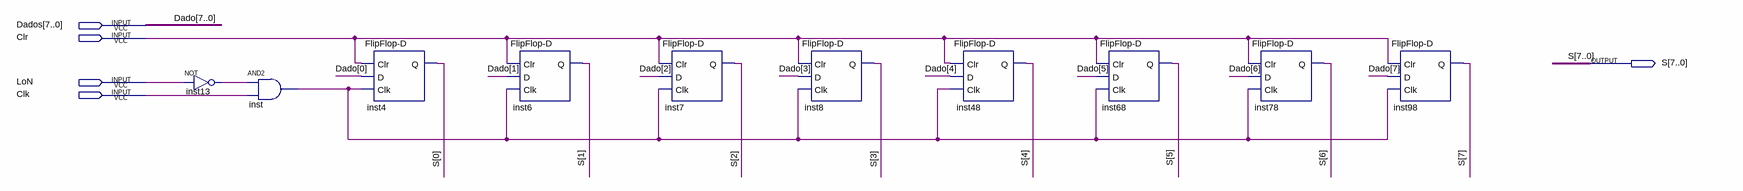
[diagram p0: schematic sheet]
// Quartus schematic Registrador-Saida.bdf as structural Verilog: 10 symbols, 5 pins
module \Registrador-Saida  (
  input  [7:0] Dados,
  input  Clr,
  input  LoN,
  input  Clk,
  output [7:0] S
);

  wire inst13_out, inst_out;

  not inst13 (inst13_out, LoN);
  and inst (inst_out, inst13_out, Clk);
  \FlipFlop-D  inst4 (.Clr(Clr), .D(Dados[0]), .Clk(inst_out), .Q(S[0]));
  \FlipFlop-D  inst6 (.Clr(Clr), .D(Dados[1]), .Clk(inst_out), .Q(S[1]));
  \FlipFlop-D  inst7 (.Clr(Clr), .D(Dados[2]), .Clk(inst_out), .Q(S[2]));
  \FlipFlop-D  inst8 (.Clr(Clr), .D(Dados[3]), .Clk(inst_out), .Q(S[3]));
  \FlipFlop-D  inst48 (.Clr(Clr), .D(Dados[4]), .Clk(inst_out), .Q(S[4]));
  \FlipFlop-D  inst68 (.Clr(Clr), .D(Dados[5]), .Clk(inst_out), .Q(S[5]));
  \FlipFlop-D  inst78 (.Clr(Clr), .D(Dados[6]), .Clk(inst_out), .Q(S[6]));
  \FlipFlop-D  inst98 (.Clr(Clr), .D(Dados[7]), .Clk(inst_out), .Q(S[7]));

  // Other names for the same wires on the sheet: Dado[7:0] = Dados
endmodule
